# Altium project UKU100.PRJPCB
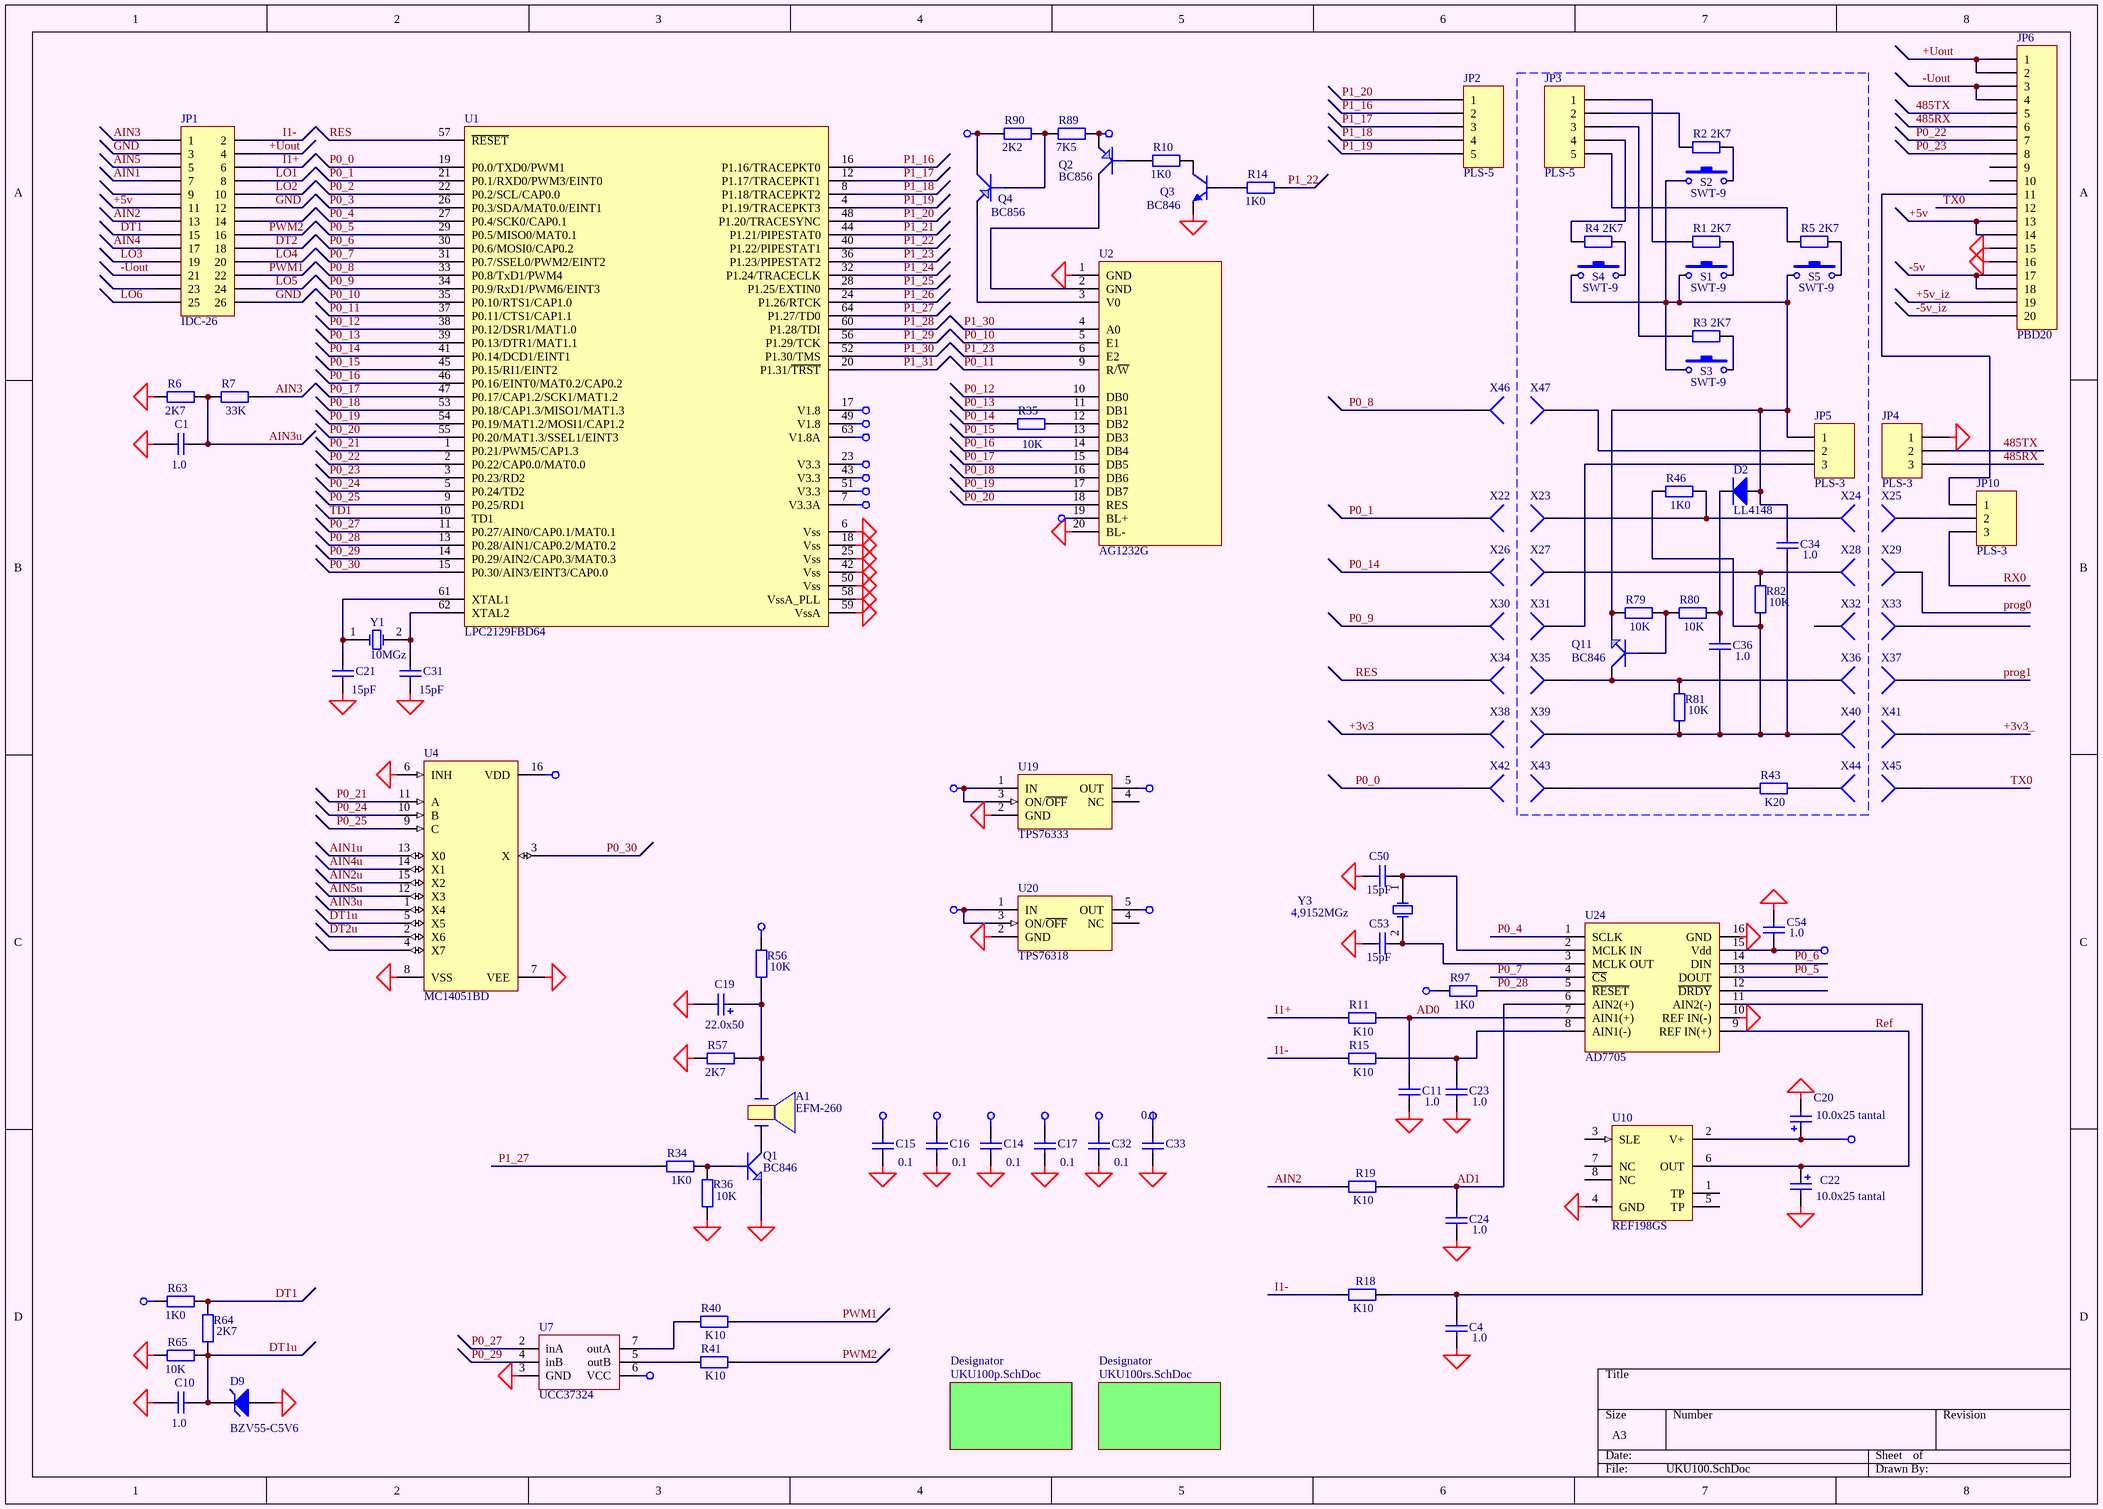
[diagram p0: UKU100.SchDoc]
3 sheets, 207 parts. Net scope: global (net labels, ports and power ports of the same name join across sheets).
Board file: UKU100.PcbDoc
Sheets:
  UKU100.SchDoc
    Designator = UKU100P.SCHDOC
    Designator = UKU100rs.SchDoc

## Sheet UKU100.SchDoc
size A3

### Parts
A1  EFM-260  [Pjezo15]
C1  1.0  [C3216-1206]
C4  1.0  [_1206]
C10  1.0  [C3216-1206]
C11  1.0  [C3216-1206]
C14  0.1  [C3216-1206]
C15  0.1  [C3216-1206]
C16  0.1  [C3216-1206]
C17  0.1  [C3216-1206]
C19  22.0x50  [el3]
C20  10.0x25 tantal  [cap_el_6_3]
C21  15pF  [C3216-1206]
C22  10.0x25 tantal  [cap_el_6_3]
C23  1.0  [C3216-1206]
C24  1.0  [C3216-1206]
C31  15pF  [C3216-1206]
C32  0.1  [C3216-1206]
C33  0.1  [C3216-1206]
C34  1.0  [C3216-1206]
C36  1.0  [C3216-1206]
C50  15pF  [_1206]
C53  15pF  [_1206]
C54  1.0  [C3216-1206]
D2  LL4148  [_1206d]
D9  BZV55-C5V6  [_1206d]
JP1  IDC-26  [SCM-26]
JP2  PLS-5  [HDR1X5]
JP3  PLS-5  [HDR1X5]
JP4  PLS-3  [HDR1X3]
JP5  PLS-3  [HDR1X3]
JP6  PBD20  [HDR2X10]
JP10  PLS-3  [HDR1X3]
Q1  BC846  [SO-G3]
Q2  BC856  [SO-G3]
Q3  BC846  [SO-G3]
Q4  BC856  [SO-G3]
Q11  BC846  [SO-G3]
R1  2K7  [_1206]
R2  2K7  [_1206]
R3  2K7  [_1206]
R4  2K7  [_1206]
R5  2K7  [_1206]
R6  2K7  [_1206]
R7  33K  [_1206]
R10  1K0  [_1206]
R11  K10  [_1206]
R14  1K0  [_1206]
R15  K10  [_1206]
R18  K10  [_1206]
R19  K10  [_1206]
R34  1K0  [_1206]
R35  10K  [_1206]
R36  10K  [_1206]
R40  K10  [_1206]
R41  K10  [_1206]
R43  K20  [_1206]
R46  1K0  [_1206]
R56  10K  [_1206]
R57  2K7  [_1206]
R63  1K0  [_1206]
R64  2K7  [_1206]
R65  10K  [_1206]
R79  10K  [_1206]
R80  10K  [_1206]
R81  10K  [_1206]
R82  10K  [_1206]
R89  7K5  [_1206]
R90  2K2  [_1206]
R97  1K0  [_1206]
S1  SWT-9  [SWT-9]
S2  SWT-9  [SWT-9]
S3  SWT-9  [SWT-9]
S4  SWT-9  [SWT-9]
S5  SWT-9  [SWT-9]
U1  LPC2129FBD64  [F-QFP10X10-G64/P.5N]
U2  AG1232G  [AG1232G]
U4  MC14051BD  [SO-G16/C5.85]
U7  UCC37324  [SO-G8]
U10  REF198GS  [SO-G8]
U19  TPS76333  [SO-G5/P.95]
U20  TPS76318  [SO-G5/P.95]
U24  AD7705  [SO-G16/D10.4]
X22  (no value)  [PIN1]
X23  (no value)  [PIN1]
X24  (no value)  [PIN1]
X25  (no value)  [PIN1]
X26  (no value)  [PIN1]
X27  (no value)  [PIN1]
X28  (no value)  [PIN1]
X29  (no value)  [PIN1]
X30  (no value)  [PIN1]
X31  (no value)  [PIN1]
X32  (no value)  [PIN1]
X33  (no value)  [PIN1]
X34  (no value)  [PIN1]
X35  (no value)  [PIN1]
X36  (no value)  [PIN1]
X37  (no value)  [PIN1]
X38  (no value)  [PIN1]
X39  (no value)  [PIN1]
X40  (no value)  [PIN1]
X41  (no value)  [PIN1]
X42  (no value)  [PIN1]
X43  (no value)  [PIN1]
X44  (no value)  [PIN1]
X45  (no value)  [PIN1]
X46  (no value)  [PIN1]
X47  (no value)  [PIN1]
Y1  10MGz  [QWARZ1]
Y3  4,9152MGz  [QWARZ1]

### Sub-sheets
Designator = UKU100p.SchDoc: no entries
Designator = UKU100rs.SchDoc: no entries

### Nets
+1v8: C14.2 C32.2 U1.17(V1.8) U1.49(V1.8) U1.63(V1.8A) U20.5(OUT)
+3v3: C33.2 U1.7(V3.3A) U1.23(V3.3) U1.43(V3.3) U1.51(V3.3) X38.1
+3v3_: C17.2 U19.5(OUT) X41.1
+5v: C15.2 C20.1 C54.2 JP1.11 JP6.13 JP6.14 Q2.2(E) R63.2 R89.2 R97.2 U2.19(BL+) U4.16(VDD) U7.6(VCC) U10.2(V+) U19.1(IN) U19.3(ON/~{OFF}) U20.1(IN) U20.3(ON/~{OFF}) U24.15(Vdd)
+5v_iz: JP6.19
+Uout: JP1.4 JP6.1 JP6.2 R56.2
-5v: C16.2 JP6.17 JP6.18 Q4.3(C) R90.1
-5v_iz: JP6.20
GND: C1.2 C4.1 C10.2 C11.1 C14.1 C15.1 C16.1 C17.1 C19.2 C20.2 C21.1 C22.2 C23.1 C24.1 C31.1 C32.1 C33.1 C50.1 C53.1 C54.1 D9.1(A) JP1.3 JP1.12 JP1.26 JP4.1 JP6.15 JP6.16 Q1.2(E) Q3.2(E) R6.2 R36.1 R57.1 R65.1 U1.6(Vss) U1.18(Vss) U1.25(Vss) U1.42(Vss) U1.50(Vss) U1.58(VssA_PLL) U1.59(VssA) U2.1(GND) U2.20(BL-) U4.6(INH) U4.7(VEE) U4.8(VSS) U7.3(GND) U10.4(GND) U19.2(GND) U20.2(GND) U24.10(REF_IN(-)) U24.16(GND)
485RX: JP4.3 JP6.6
485TX: JP4.2 JP6.5
-Uout: JP1.21 JP6.3 JP6.4
AD0: C11.2 R11.1 U24.7(AIN1(+))
AD1: C24.2 R19.1 U24.6(AIN2(+))
AIN1: JP1.7
AIN1u: U4.13(X0)
AIN2: JP1.13 R19.2
AIN2u: U4.15(X2)
AIN3: JP1.1 R7.2
AIN3u: C1.1 R6.1 R7.1 U4.1(X4)
AIN4: JP1.17
AIN4u: U4.14(X1)
AIN5: JP1.5
AIN5u: U4.12(X3)
DT1: JP1.15 R63.1 R64.1
DT1u: C10.1 D9.2(K) R64.2 R65.2 U4.5(X5)
DT2: JP1.18
DT2u: U4.2(X6)
I1+: JP1.6 R11.2
I1-: JP1.2 R15.2 R18.2
LO1: JP1.8
LO2: JP1.10
LO3: JP1.19
LO4: JP1.20
LO5: JP1.24
LO6: JP1.25
P0_0: U1.19(P0.0/TXD0/PWM1) X42.1
P0_1: U1.21(P0.1/RXD0/PWM3/EINT0) X22.1
P0_2: U1.22(P0.2/SCL/CAP0.0)
P0_3: U1.26(P0.3/SDA/MAT0.0/EINT1)
P0_4: U1.27(P0.4/SCK0/CAP0.1) U24.1(SCLK)
P0_5: U1.29(P0.5/MISO0/MAT0.1) U24.13(DOUT)
P0_6: U1.30(P0.6/MOSI0/CAP0.2) U24.14(DIN)
P0_7: U1.31(P0.7/SSEL0/PWM2/EINT2) U24.4(~{CS})
P0_8: U1.33(P0.8/TxD1/PWM4) X46.1
P0_9: U1.34(P0.9/RxD1/PWM6/EINT3) X30.1
P0_10: U1.35(P0.10/RTS1/CAP1.0) U2.5(E1)
P0_11: U1.37(P0.11/CTS1/CAP1.1) U2.9(R/~{W})
P0_12: U1.38(P0.12/DSR1/MAT1.0) U2.10(DB0)
P0_13: U1.39(P0.13/DTR1/MAT1.1) U2.11(DB1)
P0_14: R35.1 U1.41(P0.14/DCD1/EINT1) X26.1
P0_15: U1.45(P0.15/RI1/EINT2) U2.13(DB3)
P0_16: U1.46(P0.16/EINT0/MAT0.2/CAP0.2) U2.14(DB4)
P0_17: U1.47(P0.17/CAP1.2/SCK1/MAT1.2) U2.15(DB5)
P0_18: U1.53(P0.18/CAP1.3/MISO1/MAT1.3) U2.16(DB6)
P0_19: U1.54(P0.19/MAT1.2/MOSI1/CAP1.2) U2.17(DB7)
P0_20: U1.55(P0.20/MAT1.3/SSEL1/EINT3) U2.18(RES)
P0_21: U1.1(P0.21/PWM5/CAP1.3) U4.11(A)
P0_22: JP6.7 U1.2(P0.22/CAP0.0/MAT0.0)
P0_23: JP6.8 U1.3(P0.23/RD2)
P0_24: U1.5(P0.24/TD2) U4.10(B)
P0_25: U1.9(P0.25/RD1) U4.9(C)
P0_27: U1.11(P0.27/AIN0/CAP0.1/MAT0.1) U7.2(inA)
P0_28: R97.1 U1.13(P0.28/AIN1/CAP0.2/MAT0.2) U24.5(~{RESET})
P0_29: U1.14(P0.29/AIN2/CAP0.3/MAT0.3) U7.4(inB)
P0_30: U1.15(P0.30/AIN3/EINT3/CAP0.0) U4.3(X)
P1_16: JP2.2 U1.16(P1.16/TRACEPKT0)
P1_17: JP2.3 U1.12(P1.17/TRACEPKT1)
P1_18: JP2.4 U1.8(P1.18/TRACEPKT2)
P1_19: JP2.5 U1.4(P1.19/TRACEPKT3)
P1_20: JP2.1 U1.48(P1.20/TRACESYNC)
P1_21: U1.44(P1.21/PIPESTAT0)
P1_22: R14.1 U1.40(P1.22/PIPESTAT1)
P1_23: U1.36(P1.23/PIPESTAT2) U2.6(E2)
P1_24: U1.32(P1.24/TRACECLK)
P1_25: U1.28(P1.25/EXTIN0)
P1_26: U1.24(P1.26/RTCK)
P1_27: R34.1 U1.64(P1.27/TD0)
P1_28: U1.60(P1.28/TDI)
P1_29: U1.56(P1.29/TCK)
P1_30: U1.52(P1.30/TMS) U2.4(A0)
P1_31: U1.20(P1.31/~{TRST})
prog0: X29.1
prog1: X37.1
PWM1: JP1.22 R40.1
PWM2: JP1.16 R41.1
Ref: C22.1 U10.6(OUT) U24.9(REF_IN(+))
RES: U1.57(~{RESET}) X34.1
RX0: JP10.3
TD1: U1.10(TD1)
TX0: JP6.12 X45.1
NetA1_1: A1.1 Q1.3(C)
NetA1_2: A1.2 C19.1 R56.1 R57.2
NetC4_2: C4.2 R18.1 U24.11(AIN2(-))
NetC21_2: C21.2 U1.61(XTAL1) Y1.1(OSC1)
NetC23_2: C23.2 R15.1 U24.8(AIN1(-))
NetC31_2: C31.2 U1.62(XTAL2) Y1.2(OSC2)
NetC34_1: C34.1 D2.1(A) JP5.1 Q11.2(E) R79.1 S1.1 S2.1 S3.1 S4.1 S5.1
NetC34_2: C34.2 C36.2 R46.2 R81.1 R82.1 X39.1 X40.1
NetC36_1: C36.1 D2.2(K) R80.2
NetC50_2: C50.2 U24.2(MCLK_IN) Y3.1(OSC1)
NetC53_2: C53.2 U24.3(MCLK_OUT) Y3.2(OSC2)
NetJP3_1: JP3.1 R1.2
NetJP3_2: JP3.2 R2.2
NetJP3_3: JP3.3 R3.2
NetJP3_4: JP3.4 R4.2
NetJP3_5: JP3.5 R5.2
NetJP5_2: JP5.2 X47.1
NetJP5_3: JP5.3 X31.1
NetJP6_11: JP6.11 JP10.1
NetJP10_2: JP10.2 X25.1
NetQ1_1: Q1.1(B) R34.2 R36.2
NetQ2_1: Q2.1(B) R10.2
NetQ2_3: Q2.3(C) U2.2(GND)
NetQ3_1: Q3.1(B) R14.2
NetQ3_3: Q3.3(C) R10.1
NetQ4_1: Q4.1(B) R89.1 R90.2
NetQ4_2: Q4.2(E) U2.3(V0)
NetQ11_1: Q11.1(B) R79.2 R80.1
NetQ11_3: Q11.3(C) R81.2 X35.1 X36.1
NetR1_1: R1.1 S1.2
NetR2_1: R2.1 S2.2
NetR3_1: R3.1 S3.2
NetR4_1: R4.1 S4.2
NetR5_1: R5.1 S5.2
NetR35_2: R35.2 U2.12(DB2)
NetR40_2: R40.2 U7.7(outA)
NetR41_2: R41.2 U7.5(outB)
NetR43_1: R43.1 X43.1
NetR43_2: R43.2 X44.1
NetR46_1: R46.1 X23.1 X24.1
NetR82_2: R82.2 X27.1 X28.1

Not connected (* = marked no-connect by the designer): JP1 9 14 23; JP6 9 10; U4 4(X7); U10 1(TP) 3(SLE) 5(TP) 7(NC) 8(NC); U19 4(NC); U20 4(NC); U24 12(~{DRDY}); X32 1; X33 1

### Library data of the parts
A1 = PJEZ0
C1 C4 C10 C11 C23 C24 C34 C36 = Cap Semi: Capacitor (Semiconductor SIM Model); Manufacturer: Generic Components; Class I: Passive; Value: 1,0; Published: 8-Jun-2000; Revision: July-2002: Re-released for DXP Platform.; Publisher: Altium Limited; Class II: Capacitor
C14-C17 C32 C33 = Cap Semi: Capacitor (Semiconductor SIM Model); Manufacturer: Generic Components; Class I: Passive; Value: 0,1; Published: 8-Jun-2000; Revision: July-2002: Re-released for DXP Platform.; Publisher: Altium Limited; Class II: Capacitor
C19 = Cap Pol1: Polarized Capacitor (Radial); Manufacturer: Generic Components; Class I: Passive; Value: 22,0; Published: 8-Jun-2000; Revision: July-2002: Re-released for DXP Platform.; Publisher: Altium Limited; Class II: Capacitor
C20 C22 = Cap Pol3: Polarized Capacitor (Surface Mount); Manufacturer: Generic Components; Class I: Passive; Value: 10,0; Published: 8-Jun-2000; Revision: July-2002: Re-released for DXP Platform.; Publisher: Altium Limited; Class II: Capacitor
C21 C31 = Cap Semi: Capacitor (Semiconductor SIM Model); Manufacturer: Generic Components; Class I: Passive; Published: 8-Jun-2000; Revision: July-2002: Re-released for DXP Platform.; Publisher: Altium Limited; Class II: Capacitor; Value: 15pF
C50 C53 = Cap Semi: Capacitor; Manufacturer: Generic Components; Class I: Passive; Published: 8-Jun-2000; Revision: July-2002: Re-released for DXP Platform.; Publisher: Altium Limited; Class II: Capacitor; Value: 15pF
C54 = Cap Semi: Capacitor; Manufacturer: Generic Components; Class I: Passive; Value: 1,0; Published: 8-Jun-2000; Revision: July-2002: Re-released for DXP Platform.; Publisher: Altium Limited; Class II: Capacitor
D2 = Diode: Default Diode; Manufacturer: Generic Components; Class I: Discrete; Class II: Diode - Switching; Published: 8-Jun-2000; Revision: July-2002: Re-released for DXP Platform.; Publisher: Altium Limited
D9 = D Zener: Zener Diode; Manufacturer: Generic Components; Class I: Discrete; Class II: Diode - Zener; Published: 8-Jun-2000; Revision: July-2002: Re-released for DXP Platform.; Publisher: Altium Limited
JP1 = MHDR2X13: Header, 13-Pin, Dual row; Manufacturer: Generic Components; Class I: Connector; Revision: July-2002: Re-released for DXP Platform.; Publisher: Altium Limited
JP2 JP3 = Header 5: Header, 5-Pin; Manufacturer: Generic Components; Class I: Connector; Revision: July-2002: Re-released for DXP Platform.; Publisher: Altium Limited
JP4 JP5 JP10 = Header 3: Header, 3-Pin; Manufacturer: Generic Components; Class I: Connector; Revision: July-2002: Re-released for DXP Platform.; Publisher: Altium Limited
JP6 = Header 20: Header, 20-Pin; Manufacturer: Generic Components; Class I: Connector; Revision: July-2002: Re-released for DXP Platform.; Publisher: Altium Limited
Q1 Q11 = GT122: Right: 20; Bottom: 20
Q2 Q4 = GT109: Right: 20; Bottom: 20
Q3 = BC847ALT1: General Purpose Transistor NPN Silicon; Manufacturer: Motorola; Package Information: Latest Revision: 1997; Class I: Discrete; Class II: BJT - Low Power; Published: 29-Sep-2000; Revision: July-2002: Re-released for DXP Platform.; Datasheet: Latest Revision: 1997; Package Reference: 318-08; Publisher: Altium Limited
R1-R5 R7 R10 R14 R34 R35 R40 R41 R46 R56 R57 R63-R65 R79-R82 R89 R90 = Res2: Resistor; Manufacturer: Generic Components; Class I: Passive; Rule: Undefined; Published: 8-Jun-2000; Revision: July-2002: Re-released for DXP Platform.; Publisher: Altium Limited; Class II: Resistor
  R1-R5 R57 R64: Value: 2K7
  R10 R14 R34 R46 R63: Value: 1K0
  R35 R56 R65 R79-R82: Value: 10K
  R40 R41: Value: K10
  R89: Value: 7K5
  R90: Value: 2K2
R6 = Res2: Resistor; Manufacturer: Generic Components; Class I: Passive; Value: 1K; Rule: Undefined; Published: 8-Jun-2000; Revision: July-2002: Re-released for DXP Platform.; Publisher: Altium Limited; Class II: Resistor
R11 R15 R18 R19 = Res2: Resistor; Manufacturer: Generic Components; Class I: Passive; Value: 100R; Published: 8-Jun-2000; Revision: July-2002: Re-released for DXP Platform.; Publisher: Altium Limited; Class II: Resistor
R36 = Res2: Resistor; Manufacturer: Generic Components; Class I: Passive; Published: 8-Jun-2000; Revision: July-2002: Re-released for DXP Platform.; Publisher: Altium Limited; Class II: Resistor; Value: 10K
R43 = Res2: Resistor; Manufacturer: Generic Components; Class I: Passive; Value: 200R; Rule: Undefined; Published: 8-Jun-2000; Revision: July-2002: Re-released for DXP Platform.; Publisher: Altium Limited; Class II: Resistor
R97 = Res2: Resistor; Manufacturer: Generic Components; Class I: Passive; Value: 1K; Published: 8-Jun-2000; Revision: July-2002: Re-released for DXP Platform.; Publisher: Altium Limited; Class II: Resistor
S1-S5 = SWT-9: Switch; Manufacturer: Generic Components; Published: 24-Mar-1999; Revision: July-2002: Re-released for DXP Platform.; Publisher: Altium Limited
U4 = MC14051BD: 8-Channel Analog Multiplexer/Demultiplexer; Manufacturer: ON Semiconductor; Class I: Logic; Class II: Multiplexer/Encoder/Selector; Published: 15-Apr-2002; Package Reference: 751B-05; Publisher: Altium Limited
U10 = REF198GS: Precision Micropower, Low-Dropout, Voltage Reference; Manufacturer: Analog Devices; Revision 1: 10-July-2000: SIM Model Added.; Revision 2: July-2002: Re-released for DXP Platform.; Class I: Power Management; Note: Pins 7 and 8 are not connected; Pins 1 and 5 are factory test only, make no electrical connection; Published: 8-Jun-2000; Datasheet: Designer's Reference Manual CD (REV. C); Package Reference: SO-8B; Publisher: Altium Limited; Class II: Voltage Reference
U19 U20 = LP2980AIM5-3.3: Micropower SOT, 50 mA Ultra Low-Dropout Regulator; Manufacturer: National Semiconductor; Package Information: Latest Revision: Aug-1999; Class I: Power Management; Class II: Voltage Regulator; Published: 15-Apr-2002; Datasheet: Latest Revision: Oct-1999; Package Reference: MA05B; Publisher: Altium Limited
U24 = AD7705: ADC; Value: AD7705
X22-X47 = Socket: Manufacturer: Generic Components; Class I: Connector; Revision: July-2002: Re-released for DXP Platform.; Publisher: Altium Limited
Y1 Y3 = XTAL: Crystal Oscillator; Manufacturer: Generic Components; Published: 8-Jun-2000; Revision: July-2002: Re-released for DXP Platform.; Publisher: Altium Limited; Class I: Oscillator; Class II: Crystal Oscillator
  Y3: Value: 4,9152MGz

## Sheet UKU100P.SCHDOC
size A3
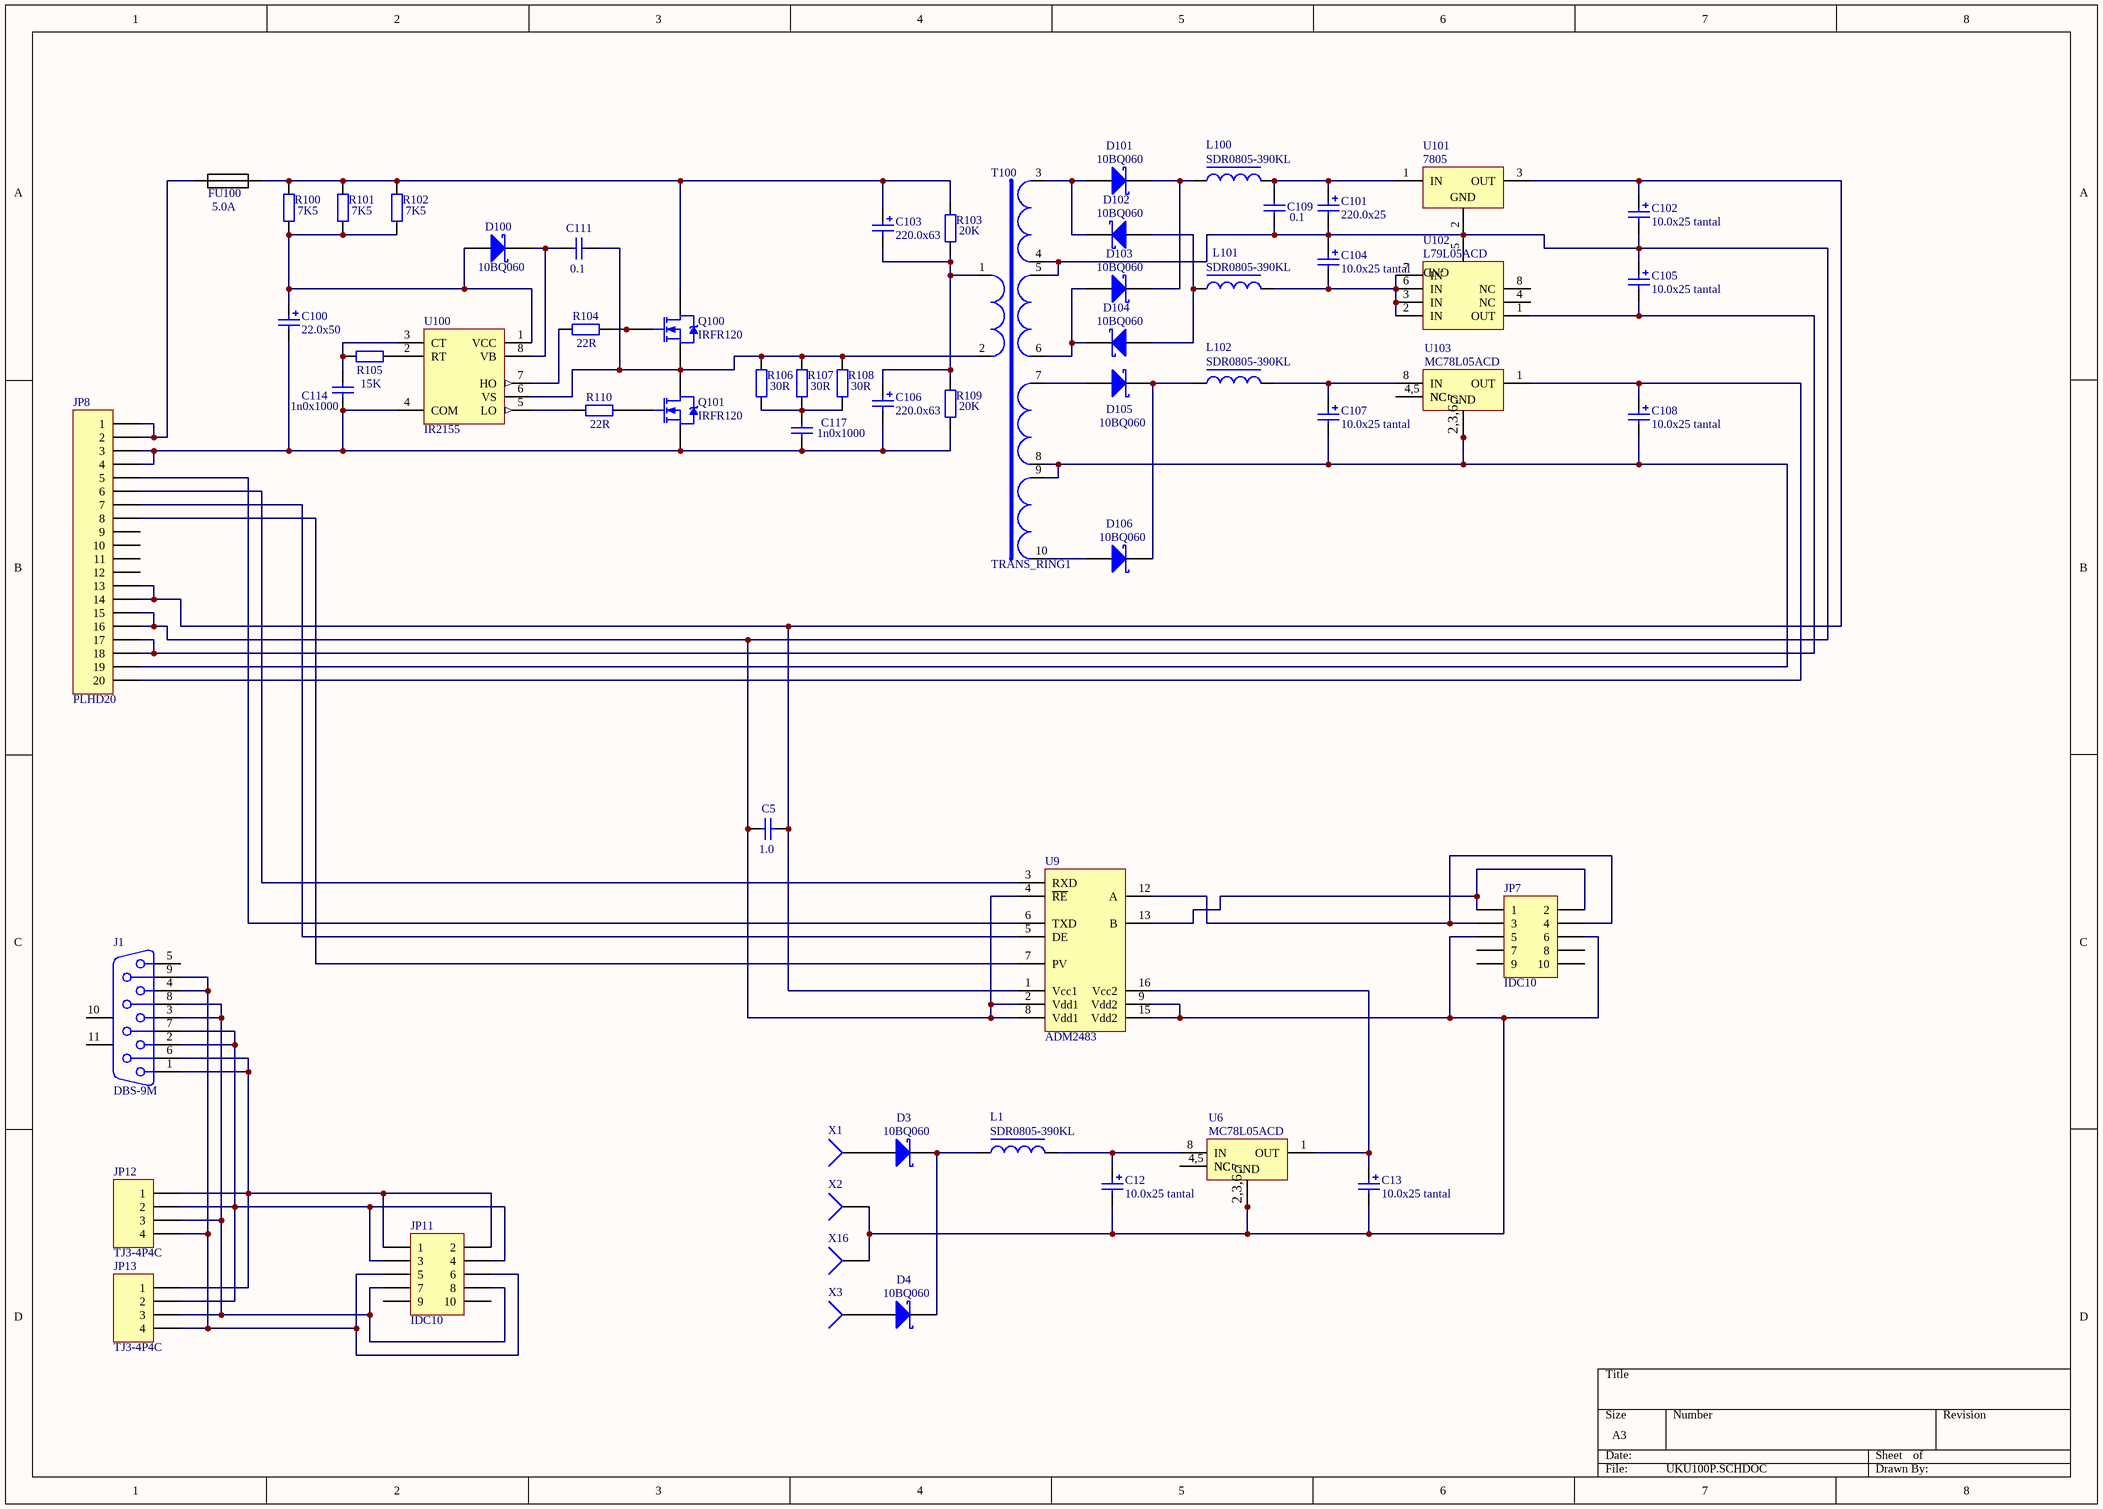
[diagram p1: UKU100P.SCHDOC]

### Parts
C5  1.0  [C3216-1206]
C12  10.0x25 tantal  [CAP_EL_6_3]
C13  10.0x25 tantal  [CAP_EL_6_3]
C100  22.0x50  [el3]
C101  220.0x25  [el5]
C102  10.0x25 tantal  [CAP_EL_6_3]
C103  220.0x63  [el5]
C104  10.0x25 tantal  [CAP_EL_6_3]
C105  10.0x25 tantal  [CAP_EL_6_3]
C106  220.0x63  [el5]
C107  10.0x25 tantal  [CAP_EL_6_3]
C108  10.0x25 tantal  [CAP_EL_6_3]
C109  0.1  [C3216-1206]
C111  0.1  [C3216-1206]
C114  1n0x1000  [C3216-1206]
C117  1n0x1000  [C3216-1206]
D3  10BQ060  [DSO-C2/X2.3]
D4  10BQ060  [DSO-C2/X2.3]
D100  10BQ060  [DSO-C2/X2.3]
D101  10BQ060  [D_6_3]
D102  10BQ060  [D_6_3]
D103  10BQ060  [D_6_3]
D104  10BQ060  [D_6_3]
D105  10BQ060  [DSO-C2/X2.3]
D106  10BQ060  [DSO-C2/X2.3]
FU100  5.0A  [FUSE2]
J1  DBS-9M  [DSUB_N9]
JP7  IDC10  [HDR2X5]
JP8  PLHD20  [HDR2X10]
JP11  IDC10  [HDR2X5]
JP12  TJ3-4P4C  [tj3-4p4c]
JP13  TJ3-4P4C  [tj3-4p4c]
L1  SDR0805-390KL  [L10x10]
L100  SDR0805-390KL  [L10x10]
L101  SDR0805-390KL  [L10x10]
L102  SDR0805-390KL  [L10x10]
Q100  IRFR120  [SIP-G3/E8]
Q101  IRFR120  [SIP-G3/E8]
R100  7K5  [_1206]
R101  7K5  [_1206]
R102  7K5  [_1206]
R103  20K  [_1206]
R104  22R  [_1206]
R105  15K  [_1206]
R106  30R  [_1206]
R107  30R  [_1206]
R108  30R  [_1206]
R109  20K  [_1206]
R110  22R  [_1206]
T100  TRANS_RING1  [trans_ring1]
U6  MC78L05ACD  [SO-G8]
U9  ADM2483  [SO-G16/D10.4]
U100  IR2155  [DIP-8/D11]
U101  7805  [7805_1]
U102  L79L05ACD  [SO-G8]
U103  MC78L05ACD  [SO-G8]
X1  (no value)  [PIN1]
X2  (no value)  [PIN1]
X3  (no value)  [PIN1]
X16  (no value)  [PIN1]

### Nets
NetC5_1: C5.1 C102.1 JP8.13 JP8.14 U9.1(Vcc1) U101.3(OUT)
NetC5_2: C5.2 C101.2 C102.2 C104.1 C105.1 C109.1 JP8.15 JP8.16 T100.4(Vss) T100.5(Vss) U9.2(Vdd1) U9.4(~{RE}) U9.8(Vdd1) U101.2(GND) U102.5(GND)
NetC12_1: C12.1 L1.2 U6.8(IN)
NetC12_2: C12.2 C13.2 JP7.5 JP7.6 U6.2(GND) U6.3(GND) U6.6(GND) U6.7(GND) U9.9(Vdd2) U9.15(Vdd2) X2.1 X16.1
NetC13_1: C13.1 U6.1(OUT) U9.16(Vcc2)
NetC100_1: C100.1 D100.1(A) R100.2 R101.2 R102.2 U100.1(VCC)
NetC100_2: C100.2 C106.2 C114.2 C117.2 JP8.3 JP8.4 Q101.3(S) R109.2 U100.4(COM)
NetC101_1: C101.1 C109.2 L100.2 U101.1(IN)
NetC103_1: C103.1 FU100.2 Q100.4(D) R100.1 R101.1 R102.1 R103.1
NetC103_2: C103.2 C106.1 R103.2 R109.1 T100.1(Vss)
NetC104_2: C104.2 L101.2 U102.2(IN) U102.3(IN) U102.6(IN) U102.7(IN)
NetC105_2: C105.2 JP8.17 JP8.18 U102.1(OUT)
NetC107_1: C107.1 L102.2 U103.8(IN)
NetC107_2: C107.2 C108.2 JP8.19 T100.8(Vss) T100.9(Vss) U103.2(GND) U103.3(GND) U103.6(GND) U103.7(GND)
NetC108_1: C108.1 JP8.20 U103.1(OUT)
NetC111_1: C111.1 D100.2(K) U100.8(VB)
NetC111_2: C111.2 Q100.3(S) Q101.4(D) R106.1 R107.1 R108.1 T100.2(Vss) U100.6(VS)
NetC114_1: C114.1 R105.1 U100.3(CT)
NetC117_1: C117.1 R106.2 R107.2 R108.2
NetD3_1: D3.1(A) X1.1
NetD3_2: D3.2(K) D4.2(K) L1.1
NetD4_1: D4.1(A) X3.1
NetD101_1: D101.1(A) D102.2(K) T100.3(Vss)
NetD101_2: D101.2(K) D103.2(K) L100.1
NetD102_1: D102.1(A) D104.1(A) L101.1
NetD103_1: D103.1(A) D104.2(K) T100.6(Vss)
NetD105_1: D105.1(A) T100.7(Vss)
NetD105_2: D105.2(K) D106.2(K) L102.1
NetD106_1: D106.1(A) T100.10(Vss)
NetFU100_1: FU100.1 JP8.1 JP8.2
NetJ1_1: J1.1 J1.6 JP11.1 JP11.2 JP12.1 JP13.1
NetJ1_2: J1.2 J1.7 JP11.3 JP11.4 JP12.2 JP13.2
NetJ1_3: J1.3 J1.8 JP11.7 JP11.8 JP12.3 JP13.3
NetJ1_4: J1.4 J1.9 JP11.5 JP11.6 JP12.4 JP13.4
NetJP7_1: JP7.1 JP7.2 U9.13(B)
NetJP7_3: JP7.3 JP7.4 U9.12(A)
NetJP8_5: JP8.5 U9.6(TXD)
NetJP8_6: JP8.6 U9.3(RXD)
NetJP8_7: JP8.7 U9.5(DE)
NetJP8_8: JP8.8 U9.7(PV)
NetQ100_1: Q100.1(G) R104.2
NetQ101_1: Q101.1(G) R110.2
NetR104_1: R104.1 U100.7(HO)
NetR105_2: R105.2 U100.2(RT)
NetR110_1: R110.1 U100.5(LO)
NetU6_4: U6.4(NC) U6.5(NC)
NetU103_4: U103.4(NC) U103.5(NC)

Not connected (* = marked no-connect by the designer): J1 5 10(MH1) 11(MH2); JP7 7 8 9 10; JP8 9 10 11 12; JP11 9 10; U102 4(NC) 8(NC)

### Notes on the sheet
- (in symbol MC78L05ACD) 4,5; 2,3,6,7

### Library data of the parts
C5 = Cap Semi: as C1 on sheet UKU100; Published: 8-Jun-2000; Revision: July-2002: Re-released for DXP Platform.; Publisher: Altium Limited; Class II: Capacitor
C12 C13 C102 C104 C105 C107 C108 = Cap Pol1: Polarized Capacitor (Radial); Manufacturer: Generic Components; Class I: Passive; Value: 10,0x25; Published: 8-Jun-2000; Revision: July-2002: Re-released for DXP Platform.; Publisher: Altium Limited; Class II: Capacitor
C100 = Cap Pol1: Polarized Capacitor (Radial); Manufacturer: Generic Components; Class I: Passive; Value: 22,0x50; Published: 8-Jun-2000; Revision: July-2002: Re-released for DXP Platform.; Publisher: Altium Limited; Class II: Capacitor
C101 = Cap Pol1: Polarized Capacitor (Radial); Manufacturer: Generic Components; Class I: Passive; Value: 220,0x25; Published: 8-Jun-2000; Revision: July-2002: Re-released for DXP Platform.; Publisher: Altium Limited; Class II: Capacitor
C103 C106 = Cap Pol1: Polarized Capacitor (Radial); Manufacturer: Generic Components; Class I: Passive; Value: 220,0x63; Published: 8-Jun-2000; Revision: July-2002: Re-released for DXP Platform.; Publisher: Altium Limited; Class II: Capacitor
C109 C111 = Cap Semi: as C14 on sheet UKU100; Published: 8-Jun-2000; Revision: July-2002: Re-released for DXP Platform.; Publisher: Altium Limited; Class II: Capacitor
C114 C117 = Cap Semi: Capacitor (Semiconductor SIM Model); Manufacturer: Generic Components; Class I: Passive; Value: 1000; Published: 8-Jun-2000; Revision: July-2002: Re-released for DXP Platform.; Publisher: Altium Limited; Class II: Capacitor
D3 D4 D100-D106 = 10BQ015: Schottky Rectifier; Manufacturer: International Rectifier; Revision 1: 10-July-2000: SIM Model Added.; Revision 2: July-2002: Re-released for DXP Platform.; Class I: Discrete; Class II: Rectifier - Schottky; Published: 8-Jun-2000; Datasheet: Latest Revision: PD-2.396A; Package Reference: DO-214AA; Publisher: Altium Limited
FU100 = FUSE
J1 = D Connector 9: Receptacle Assembly, 9 Position, Right Angle; Manufacturer: Generic Components; Package Information: Latest Revision: O; Positions: 9; Published: 15-Jun-2001; Revision: July-2002: Re-released for DXP Platform.; Datasheet: (1-Sep-1999); Package Reference: 788750; Publisher: Altium Limited; Class I: Connector; Orientation: Right Angle; Gender: Receptacle
JP7 JP11 = Header 5X2: Header, 5-Pin, Dual row; Manufacturer: Generic Components; Class I: Connector; Revision: July-2002: Re-released for DXP Platform.; Publisher: Altium Limited
JP8 = Header 20: as JP6 on sheet UKU100; Revision: July-2002: Re-released for DXP Platform.; Publisher: Altium Limited
JP12 JP13 = Header 4: Header, 4-Pin; Manufacturer: Generic Components; Class I: Connector; Revision: July-2002: Re-released for DXP Platform.; Publisher: Altium Limited
L1 L100-L102 = Inductor Konstr 2: Magnetic-Core Inductor; Manufacturer: Generic Components; Class I: Passive; Published: 24-Mar-1999; Revision: July-2002: Re-released for DXP Platform.; Publisher: Altium Limited; Class II: Inductor
Q100 Q101 = IRFR120: HEXFET N-Channel Power MOSFET; Manufacturer: International Rectifier; Revision 1: 10-July-2000: SIM Model Added.; Revision 2: July-2002: Re-released for DXP Platform.; Class I: Discrete; Class II: MOSFET - Power; Note: Pin 2 is trimmed and is electrically connected to Drain.; Published: 8-Jun-2000; Datasheet: Latest Revision: PD-9.523D; Package Reference: TO-252AA; Publisher: Altium Limited
R100-R102 = Res2: Resistor; Manufacturer: Generic Components; Class I: Passive; Value: 33K; Rule: Undefined; Published: 8-Jun-2000; Revision: July-2002: Re-released for DXP Platform.; Publisher: Altium Limited; Class II: Resistor
R103 R105 R109 = Res2: as R1 on sheet UKU100; Published: 8-Jun-2000; Revision: July-2002: Re-released for DXP Platform.; Publisher: Altium Limited; Class II: Resistor
  R103 R109: Value: 20K
  R105: Value: 15K
R104 R110 = Res2: Resistor; Manufacturer: Generic Components; Class I: Passive; Value: 22; Rule: Undefined; Published: 8-Jun-2000; Revision: July-2002: Re-released for DXP Platform.; Publisher: Altium Limited; Class II: Resistor
R106-R108 = Res2: Resistor; Manufacturer: Generic Components; Class I: Passive; Value: 30; Rule: Undefined; Published: 8-Jun-2000; Revision: July-2002: Re-released for DXP Platform.; Publisher: Altium Limited; Class II: Resistor
U6 U103 = MC78L05ACD: 3-Terminal Low-Current Positive Fixed Voltage Regulator; Manufacturer: Motorola; Class I: Power Management; Published: 15-Apr-2002; Datasheet: Linear and Interface Integrated Circuits, DL128 Rev2 (1988); Package Reference: 751-02; Publisher: Altium Limited; Class II: Voltage Regulator
U100 = IR2155: Self-Oscillating Half-Bridge Driver; Manufacturer: International Rectifier; Class I: Interface; Published: 8-Jun-2000; Revision: July-2002: Re-released for DXP Platform.; Datasheet: Latest Revision: PD60029I; Package Reference: PDIP8; Publisher: Altium Limited; Class II: Bridge Driver
U101 = 7805: 3-Terminal Positive Fixed Voltage Regulator; Manufacturer: Motorola; Class I: Power Management; Note: Pin 2 is electrically connected to TAB; Published: 15-Apr-2002; Datasheet: Linear and Interface Integrated Circuits, DL128 Rev2 (1988); Package Reference: 221A-04; Publisher: Altium Limited; Class II: Voltage Regulator
U102 = L79L05ACD: Negative Voltage Regulator; Manufacturer: ST-Microelectronics; Package Information: Latest Revision: Jul-1998; Class I: Power Management; Published: 24-Aug-2001; Revision: July-2002: Re-released for DXP Platform.; Datasheet: Latest Revision: Apr-1999; Package Reference: SO8; Publisher: Altium Limited; Class II: Voltage Regulator
X1-X3 X16 = Socket: as X22 on sheet UKU100; Revision: July-2002: Re-released for DXP Platform.; Publisher: Altium Limited

## Sheet UKU100rs.SchDoc
size B
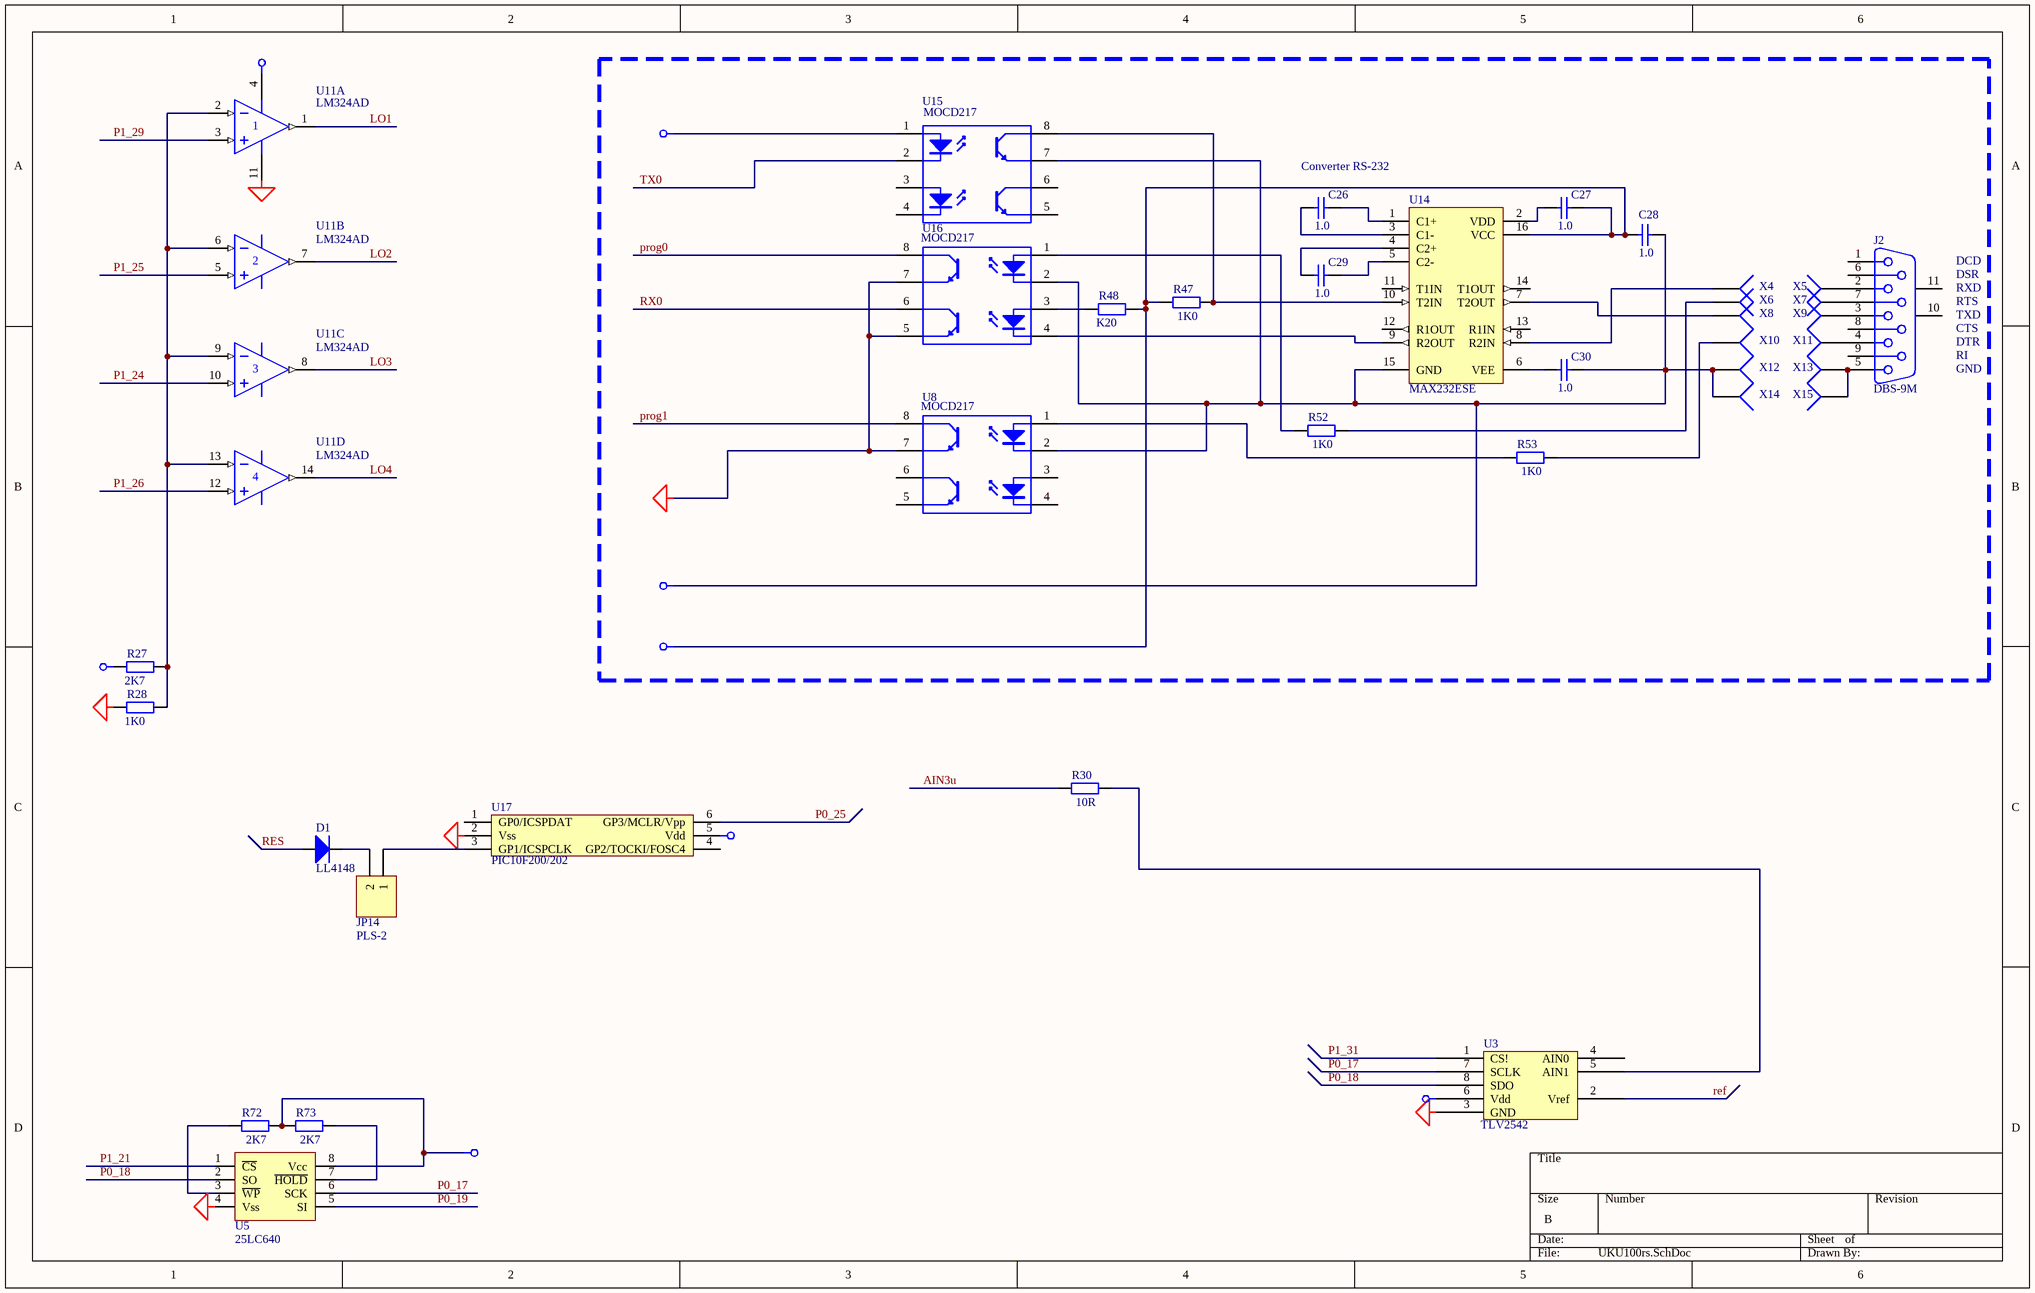
[diagram p2: UKU100rs.SchDoc]

### Parts
C26  1.0  [C3216-1206]
C27  1.0  [_1206]
C28  1.0  [C3216-1206]
C29  1.0  [C3216-1206]
C30  1.0  [C3216-1206]
D1  LL4148  [_1206D]
J2  DBS-9M  [DSUB_N9]
JP14  PLS-2  [HDR1X2]
R27  2K7  [_1206]
R28  1K0  [_1206]
R30  10R  [_1206]
R47  1K0  [_1206]
R48  K20  [_1206]
R52  1K0  [_1206]
R53  1K0  [_1206]
R72  2K7  [_1206]
R73  2K7  [_1206]
U3  TLV2542  [SO-G8]
U5  25LC640  [SO-G8/D5]
U8  MOCD217  [SO-G8]
U11  LM324AD  [SO-G14/G3.3]  (parts A,B,C,D of 4)
U14  MAX232ESE  [SO-G16]
U15  MOCD217  [SO-G8]
U16  MOCD217  [SO-G8]
U17  PIC10F200/202  [SOT23 - 6]
X4  (no value)  [PIN1]
X5  (no value)  [PIN1]
X6  (no value)  [PIN1]
X7  (no value)  [PIN1]
X8  (no value)  [PIN1]
X9  (no value)  [PIN1]
X10  (no value)  [PIN1]
X11  (no value)  [PIN1]
X12  (no value)  [PIN1]
X13  (no value)  [PIN1]
X14  (no value)  [PIN1]
X15  (no value)  [PIN1]

### Nets
+3v3: U17.5(Vdd)
+3v3_: U15.1(A)
+5v: R27.1 R72.2 R73.1 U3.6(Vdd) U5.8(Vcc) U11.4(V+)
+5v_iz: C27.2 C28.1 R47.1 R48.2 U14.16(VCC)
-5v_iz: C28.2 C30.2 U8.2(K) U14.15(GND) U15.7(E) U16.2(K) X12.1 X14.1
GND: R28.1 U3.3(GND) U5.4(Vss) U8.7(E) U11.11(V-) U16.5(E) U16.7(E) U17.2(Vss)
AIN3u: R30.1
LO1: U11.1(OUT)
LO2: U11.7(OUT)
LO3: U11.8(OUT)
LO4: U11.14(OUT)
P0_17: U3.7(SCLK) U5.6(SCK)
P0_18: U3.8(SDO) U5.2(SO)
P0_19: U5.5(SI)
P0_25: U17.6(GP3/MCLR/Vpp)
P1_21: U5.1(~{CS})
P1_24: U11.10(IN+)
P1_25: U11.5(IN+)
P1_26: U11.12(IN+)
P1_29: U11.3(IN+)
P1_31: U3.1(CS!)
prog0: U16.8(C)
prog1: U8.8(C)
Ref: U3.2(Vref)
RES: D1.1(A)
RX0: U16.6(C)
TX0: U15.2(K)
NetC26_1: C26.1 U14.3(C1-)
NetC26_2: C26.2 U14.1(C1+)
NetC27_1: C27.1 U14.2(VDD)
NetC29_1: C29.1 U14.4(C2+)
NetC29_2: C29.2 U14.5(C2-)
NetC30_1: C30.1 U14.6(VEE)
NetD1_2: D1.2(K) JP14.2
NetJ2_2: J2.2 X5.1
NetJ2_3: J2.3 X9.1
NetJ2_4: J2.4 X11.1
NetJ2_5: J2.5 X13.1 X15.1
NetJ2_7: J2.7 X7.1
NetJP14_1: JP14.1 U17.3(GP1/ICSPCLK)
NetR27_2: R27.2 R28.2 U11.2(IN-) U11.6(IN-) U11.9(IN-) U11.13(IN-)
NetR30_2: R30.2 U3.5(AIN1)
NetR47_2: R47.2 U14.10(T2IN) U15.8(C)
NetR48_1: R48.1 U16.3(A)
NetR52_1: R52.1 U16.1(A)
NetR52_2: R52.2 X6.1
NetR53_1: R53.1 U8.1(A)
NetR53_2: R53.2 X10.1
NetR72_1: R72.1 U5.3(~{WP})
NetR73_2: R73.2 U5.7(~{HOLD})
NetU14_7: U14.7(T2OUT) X8.1
NetU14_8: U14.8(R2IN) X4.1
NetU14_9: U14.9(R2OUT) U16.4(K)

Not connected (* = marked no-connect by the designer): J2 1 6 8 9 10(MH1) 11(MH2); U3 4(AIN0); U8 3(A) 4(K) 5(E) 6(C); U14 11(T1IN) 12(R1OUT) 13(R1IN) 14(T1OUT); U15 3(A) 4(K) 5(E) 6(C); U17 1(GP0/ICSPDAT) 4(GP2/TOCKI/FOSC4)

### Notes on the sheet
- Converter RS-232
- (near J2) DCD
- (near J2) DSR
- (near J2) RXD
- (near J2) RTS
- (near J2) TXD
- (near J2) CTS
- (near J2) DTR
- (near J2) RI
- (near J2) GND
- (in symbol LM324AD, part D) 4

### Library data of the parts
C26-C30 = Cap Semi: as C1 on sheet UKU100; Published: 8-Jun-2000; Revision: July-2002: Re-released for DXP Platform.; Publisher: Altium Limited; Class II: Capacitor
D1 = Diode: as D2 on sheet UKU100; Published: 8-Jun-2000; Revision: July-2002: Re-released for DXP Platform.; Publisher: Altium Limited
J2 = D Connector 9: as J1 on sheet UKU100P; Published: 15-Jun-2001; Revision: July-2002: Re-released for DXP Platform.; Datasheet: (1-Sep-1999); Package Reference: 788750; Publisher: Altium Limited; Class I: Connector; Orientation: Right Angle; Gender: Receptacle
JP14 = Header 2: Header, 2-Pin; Manufacturer: Generic Components; Class I: Connector; Revision: July-2002: Re-released for DXP Platform.; Publisher: Altium Limited
R27 R30 R47 R52 R53 R72 R73 = Res2: as R1 on sheet UKU100; Published: 8-Jun-2000; Revision: July-2002: Re-released for DXP Platform.; Publisher: Altium Limited; Class II: Resistor
  R27 R72 R73: Value: 2K7
  R30: Value: 10R
  R47 R52 R53: Value: 1K0
R28 = Res2: Resistor; Manufacturer: Generic Components; Class I: Passive; Value: 2K7; Rule: Undefined; Published: 8-Jun-2000; Revision: July-2002: Re-released for DXP Platform.; Publisher: Altium Limited; Class II: Resistor
R48 = Res2: as R43 on sheet UKU100; Published: 8-Jun-2000; Revision: July-2002: Re-released for DXP Platform.; Publisher: Altium Limited; Class II: Resistor
U11 = LM324AD: Quadruple Operational Amplifier; Manufacturer: Texas Instruments; Package Information: Latest Revision: Jan-1998; Published: 15-Apr-2002; Revision: 23-Sep-2002: PCB footprint, 'SO-G8/E2.5' replaced.; Datasheet: Linear Circuits Data Book 1989 Volume 1 (Jan-1989); Package Reference: D014; Publisher: Altium Limited; Class I: Amplifier; Class II: Operational Amplifier
U14 = MAX232ESE: +5V Powered, Multi-Channel RS-232 Driver/Receiver; Manufacturer: Maxim; Class I: Communication; Class II: Transceiver; Published: 16-Jan-2001; Revision: July-2002: Re-released for DXP Platform.; Package Reference: NSO16; Publisher: Altium Limited
X4-X15 = Socket: as X22 on sheet UKU100; Revision: July-2002: Re-released for DXP Platform.; Publisher: Altium Limited

## Nets that join several sheets
+3v3: UKU100 (6 pins), UKU100rs (U17.5)
+3v3_: UKU100 (C17.2 U19.5 X41.1), UKU100rs (U15.1)
+5v: UKU100 (19 pins), UKU100rs (6 pins)
+5v_iz: UKU100 (JP6.19), UKU100rs (5 pins)
-5v_iz: UKU100 (JP6.20), UKU100rs (8 pins)
GND: UKU100 (51 pins), UKU100rs (8 pins)
AIN3u: UKU100 (C1.1 R6.1 R7.1 U4.1), UKU100rs (R30.1)
LO1: UKU100 (JP1.8), UKU100rs (U11.1)
LO2: UKU100 (JP1.10), UKU100rs (U11.7)
LO3: UKU100 (JP1.19), UKU100rs (U11.8)
LO4: UKU100 (JP1.20), UKU100rs (U11.14)
P0_17: UKU100 (U1.47 U2.15), UKU100rs (U3.7 U5.6)
P0_18: UKU100 (U1.53 U2.16), UKU100rs (U3.8 U5.2)
P0_19: UKU100 (U1.54 U2.17), UKU100rs (U5.5)
P0_25: UKU100 (U1.9 U4.9), UKU100rs (U17.6)
P1_21: UKU100 (U1.44), UKU100rs (U5.1)
P1_24: UKU100 (U1.32), UKU100rs (U11.10)
P1_25: UKU100 (U1.28), UKU100rs (U11.5)
P1_26: UKU100 (U1.24), UKU100rs (U11.12)
P1_29: UKU100 (U1.56), UKU100rs (U11.3)
P1_31: UKU100 (U1.20), UKU100rs (U3.1)
prog0: UKU100 (X29.1), UKU100rs (U16.8)
prog1: UKU100 (X37.1), UKU100rs (U8.8)
Ref: UKU100 (C22.1 U10.6 U24.9), UKU100rs (U3.2)
RES: UKU100 (U1.57 X34.1), UKU100rs (D1.1)
RX0: UKU100 (JP10.3), UKU100rs (U16.6)
TX0: UKU100 (JP6.12 X45.1), UKU100rs (U15.2)